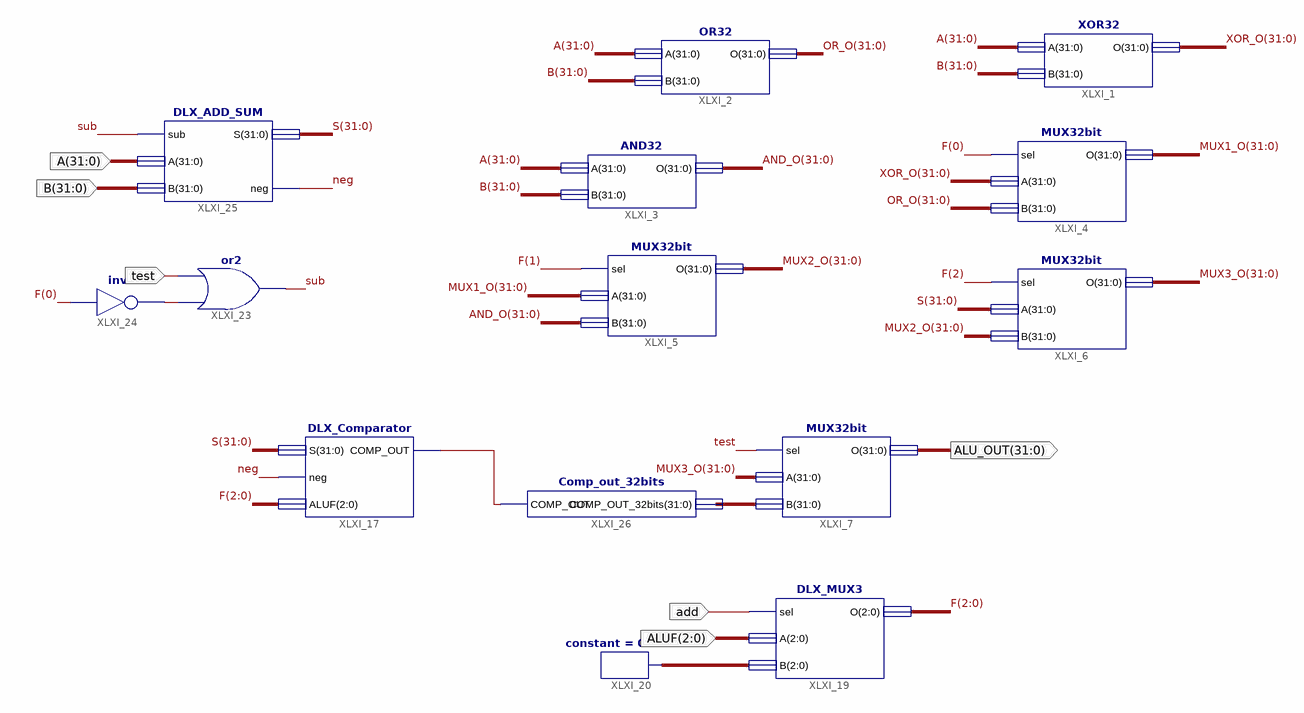
[diagram p0: schematic sheet 1]
// Xilinx ISE schematic DLX_ALU.sch (spartan6) as structural Verilog: 14 symbols, 6 ports
module DLX_ALU (
  input  [31:0] A,
  input  [31:0] B,
  input  [2:0] ALUF,
  input  test,
  input  add,
  output [31:0] ALU_OUT
);

  wire COMP_OUT, neg, sub, XLXN_79;
  wire [2:0] F, XLXN_73;
  wire [31:0] AND_O, MUX1_O, MUX2_O, MUX3_O, OR_O, S, XLXN_68, XOR_O;

  MUX32bit XLXI_6 (.sel(F[2]), .A(S), .B(MUX2_O), .O(MUX3_O));
  MUX32bit XLXI_7 (.sel(test), .A(MUX3_O), .B(XLXN_68), .O(ALU_OUT));
  OR32 XLXI_2 (.A(A), .B(B), .O(OR_O));
  XOR32 XLXI_1 (.A(A), .B(B), .O(XOR_O));
  AND32 XLXI_3 (.A(A), .B(B), .O(AND_O));
  MUX32bit XLXI_4 (.sel(F[0]), .A(XOR_O), .B(OR_O), .O(MUX1_O));
  MUX32bit XLXI_5 (.sel(F[1]), .A(MUX1_O), .B(AND_O), .O(MUX2_O));
  DLX_Comparator XLXI_17 (.S(S), .neg(neg), .ALUF(F), .COMP_OUT(COMP_OUT));
  DLX_MUX3 XLXI_19 (.sel(add), .A(ALUF), .B(XLXN_73), .O(F));
  constant #(.CValue("00000003")) XLXI_20 (.O(XLXN_73));
  or XLXI_23 (sub, XLXN_79, test);
  not XLXI_24 (XLXN_79, F[0]);
  DLX_ADD_SUM XLXI_25 (.sub(sub), .A(A), .B(B), .S(S), .neg(neg));
  Comp_out_32bits XLXI_26 (.COMP_OUT(COMP_OUT), .COMP_OUT_32bits(XLXN_68));
endmodule
